# EAGLE schematic tiu_tracking_tag (EAGLE 5.11)
ABBREV: jn5; PROJECT: JeeNode v5
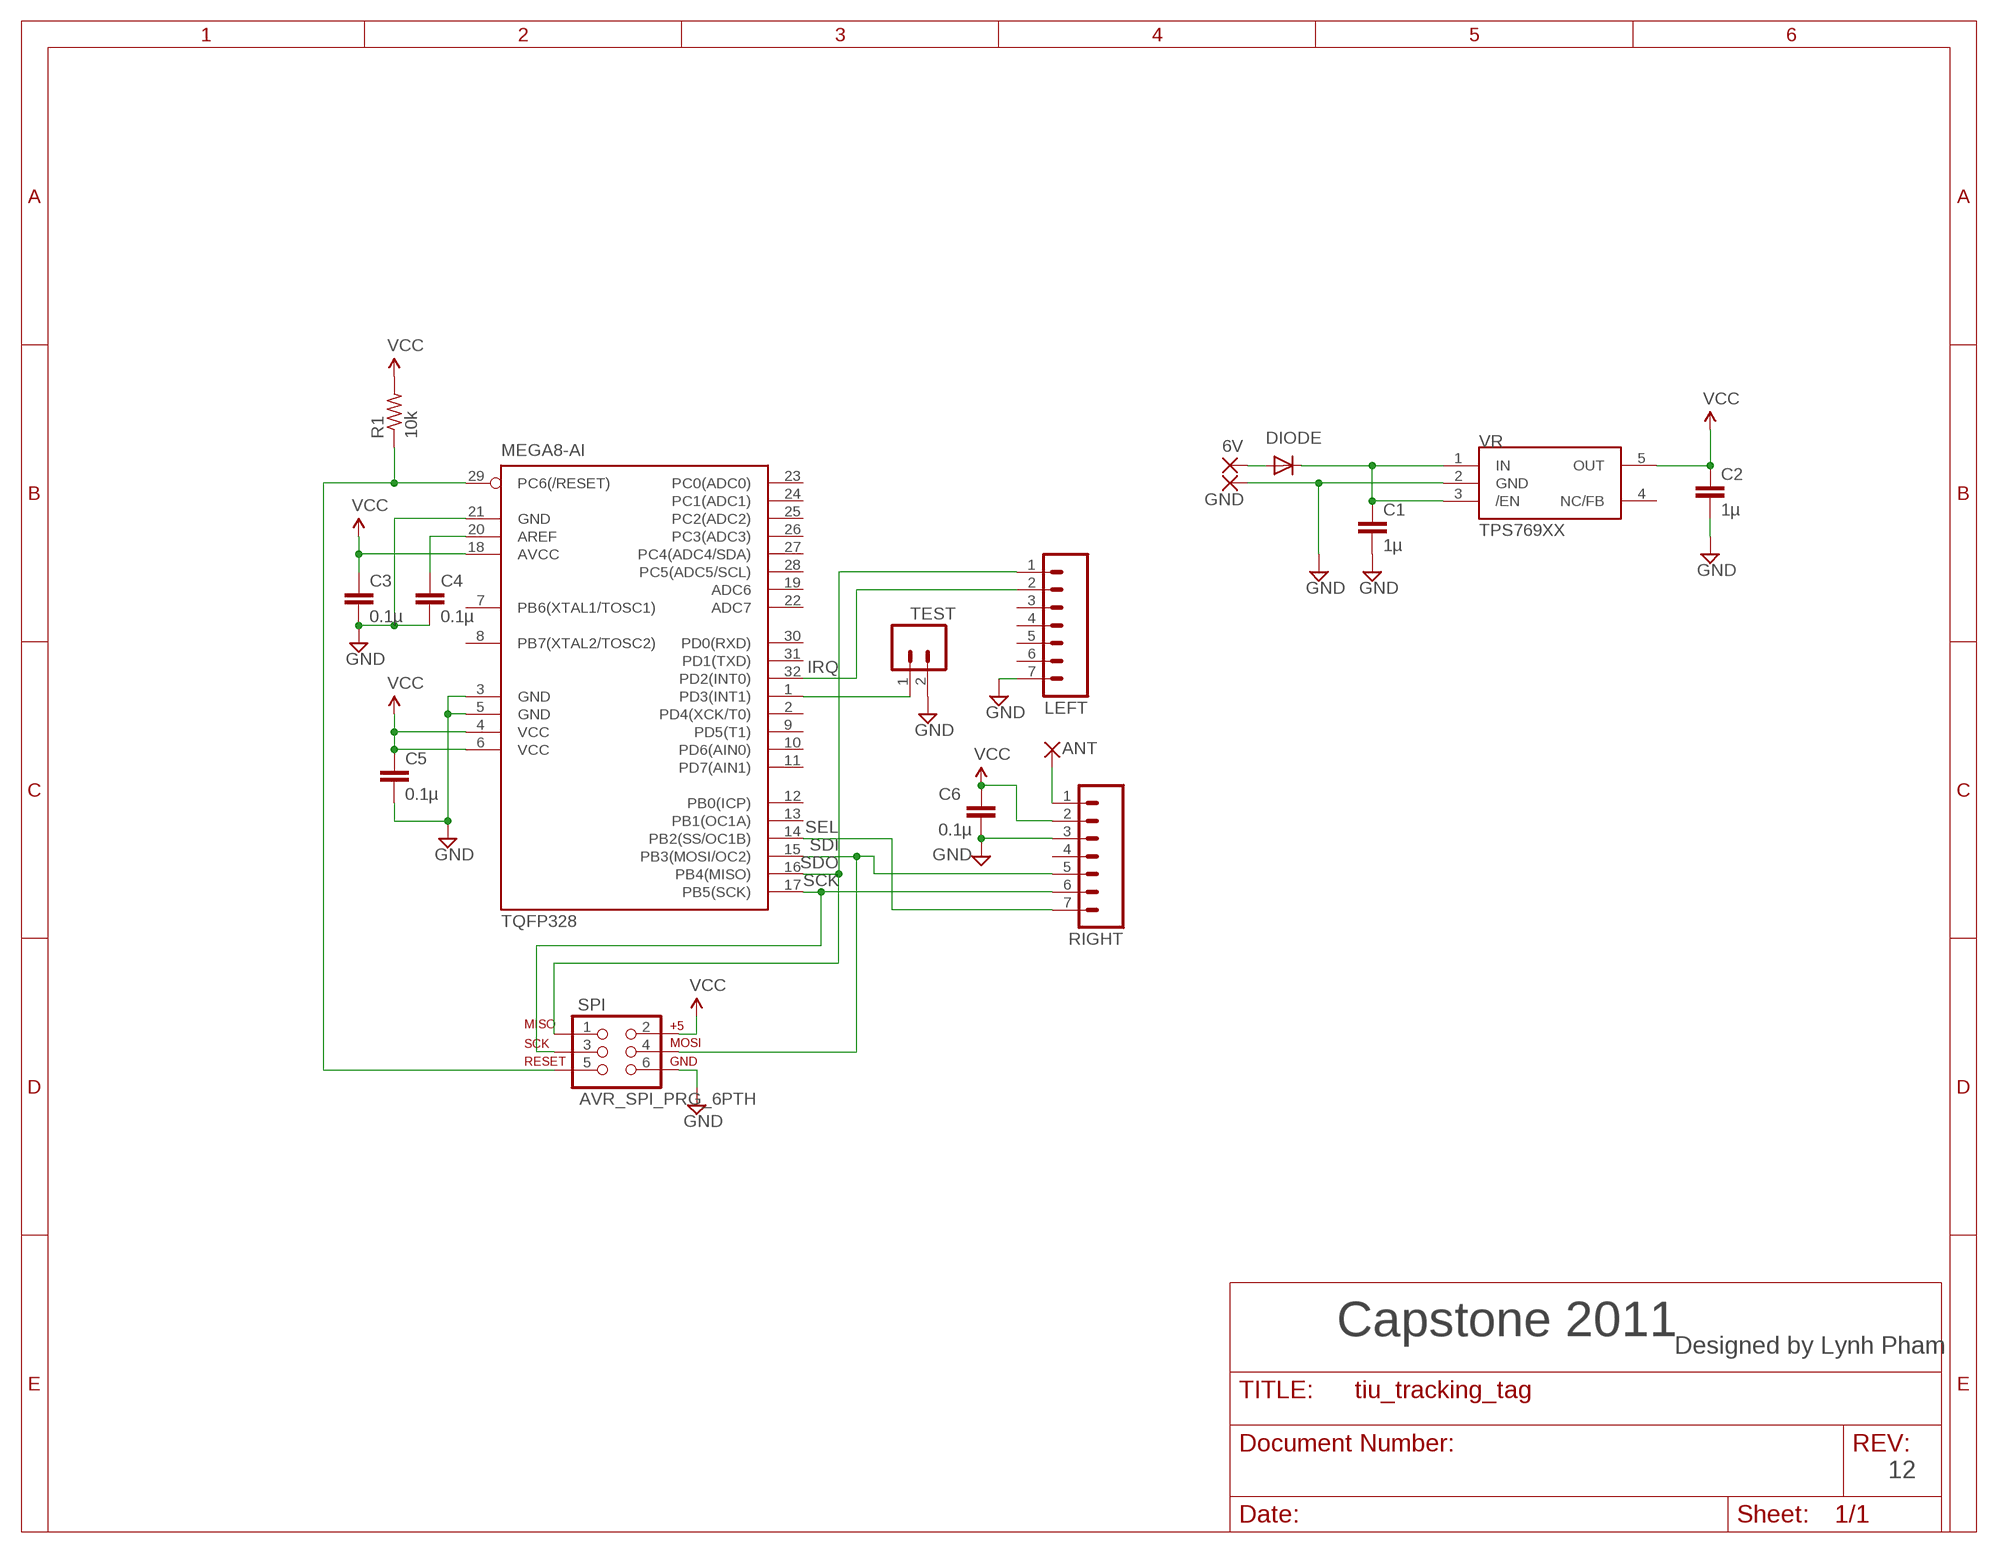
[diagram p0: schematic, sheet 1]

## Parts
6V  1,6/0,8  [1,6/0,8]
ANT  1,6/0,8  [1,6/0,8]
C1  1µ  CAP0805  [0805]
C2  1µ  CAP0805  [0805]
C3  0.1µ  CAP0805  [0805]
C4  0.1µ  CAP0805  [0805]
C5  0.1µ  CAP0805  [0805]
C6  0.1µ  CAP0805  [0805]
DIODE  DIODESOD  [SOD-323]
GND  1,6/0,8  [1,6/0,8]
LEFT  M07  [1X07]
R1  10k  R-US_M0805  [M0805]
RIGHT  M07  [1X07]
SPI  AVR_SPI_PRG_6PTH  [2X3]
TEST  M02PTH  [1X02]
TQFP328  MEGA8-AI  [TQFP32-08]
VR  TPS769XX  [SOT23-5L]

## Nets
GND [power]: C1.2 C2.2 C3.2 C4.2 C5.2 C6.2 GND.1(P) LEFT.7 RIGHT.3 SPI.6 TEST.2 TQFP328.3(GND) TQFP328.5(GND) TQFP328.21(GND) VR.2(GND)
IRQ: LEFT.2 TQFP328.32(PD2(INT0))
N$1: C1.1 DIODE.1(C) VR.1(IN) VR.3(/EN)
N$2: 6V.1(P) DIODE.2(A)
N$3: TEST.1 TQFP328.1(PD3(INT1))
N$4: ANT.1(P) RIGHT.1
N$7: C4.1 TQFP328.20(AREF)
N$16: R1.1 SPI.5 TQFP328.29(PC6(/RESET))
SCK: RIGHT.6 SPI.3 TQFP328.17(PB5(SCK))
SDI: RIGHT.5 SPI.4 TQFP328.15(PB3(MOSI/OC2))
SDO: LEFT.1 SPI.1 TQFP328.16(PB4(MISO))
SEL: RIGHT.7 TQFP328.14(PB2(SS/OC1B))
VCC [power]: C2.1 C3.1 C5.1 C6.1 R1.2 RIGHT.2 SPI.2 TQFP328.4(VCC) TQFP328.6(VCC) TQFP328.18(AVCC) VR.5(OUT)
Unconnected: LEFT.3 LEFT.4 LEFT.5 LEFT.6 RIGHT.4 TQFP328.2(PD4(XCK/T0)) TQFP328.7(PB6(XTAL1/TOSC1)) TQFP328.8(PB7(XTAL2/TOSC2)) TQFP328.9(PD5(T1)) TQFP328.10(PD6(AIN0)) TQFP328.11(PD7(AIN1)) TQFP328.12(PB0(ICP)) TQFP328.13(PB1(OC1A)) TQFP328.19(ADC6) TQFP328.22(ADC7) TQFP328.23(PC0(ADC0)) TQFP328.24(PC1(ADC1)) TQFP328.25(PC2(ADC2)) TQFP328.26(PC3(ADC3)) TQFP328.27(PC4(ADC4/SDA)) TQFP328.28(PC5(ADC5/SCL)) TQFP328.30(PD0(RXD)) TQFP328.31(PD1(TXD)) VR.4(NC/FB)

## Notes on the sheet
- Capstone 2011
- Designed by Lynh Pham
- 12

## Library data of the parts
6V ANT GND = JeeLabs:1,6/0,8: THROUGH-HOLE PAD
C1-C6 = SparkFun:CAP: Capacitor Standard 0603 ceramic capacitor, and 0.1" leaded capacitor.
DIODE = SparkFun:DIODE: Diode These are standard reverse protection diodes and small signal diodes. SMA package can handle up to about 1A. SOD-323 can handle about 200mA. What the SOD-323 package when ordering, there are some mfgs out there that are 5-pin packages.
LEFT RIGHT = M7_02mm:M07: Header 7 Standard 7-pin 0.1" header. Use with straight break away headers (SKU : PRT-00116), right angle break away headers (PRT-00553), swiss pins (PRT-00743), machine pins (PRT-00117), and female headers (PRT-00115). NOTES ON THE VARIANTS LOCK and LOCK_LONGPADS... This footprint was designed to help hold the alignment of a through-hole component (i.e. 7-pin header) while soldering it into place. You may notice that each hole has been shifted either up or down by 0.005 of an inch from it's more standard position (which is usually a perfectly straight line). This slight alteration caused the pins (the squares in the middle) to touch the edges of the holes. Because they are alternating, it causes a "brace" to hold the header in place. 0.005 has proven to be the perfect amount of "off-center" position when using our standard breakaway headers. Although looks a little odd when you look at the bare footprint, once you have a header in there, the alteration is very hard to notice. Also, if you push a header all the way into place, it is covered up entirely on the bottom side. This idea of altering the position of holes to aid alignment will be further integrated into the Sparkfun Library for other footprints. It can help hold any component with 3 or more connection pins.
R1 = resistor:R-US_: RESISTOR, American symbol
SPI = SparkFun:AVR_SPI_PRG_6: AVR ISP 6 Pin This is the reduced ISP connector for AVR programming. Common on Arduino. This footprint will take up less PCB space and can be used with a 10-pin to 6-pin adapter such as SKU: BOB-08508
TEST = SparkFun:M02: Header 2 Standard 2-pin 0.1" header. Use with straight break away headers (SKU : PRT-00116), right angle break away headers (PRT-00553), swiss pins (PRT-00743), machine pins (PRT-00117), and female headers (PRT-00115). Molex polarized connector foot print use with SKU : PRT-08233 with associated crimp pins and housings.
TQFP328 = atmel:MEGA8: MICROCONTROLLER 8 Kbytes FLASH, 1 kbytes SRAM, 512 bytes EEPROM, USART, 6-channel 10 bit ADC, 2-channel 8 bit ADC Pin compatible with Atmega48, ATMega88, ATMega168 Source: avr.lbr
VR = tps769xx:TPS769XX

## Net classes
1 power: width 0.381 mm, clearance 0.254 mm